# EAGLE board Armaz BBB Cape (EAGLE 7.3.0)
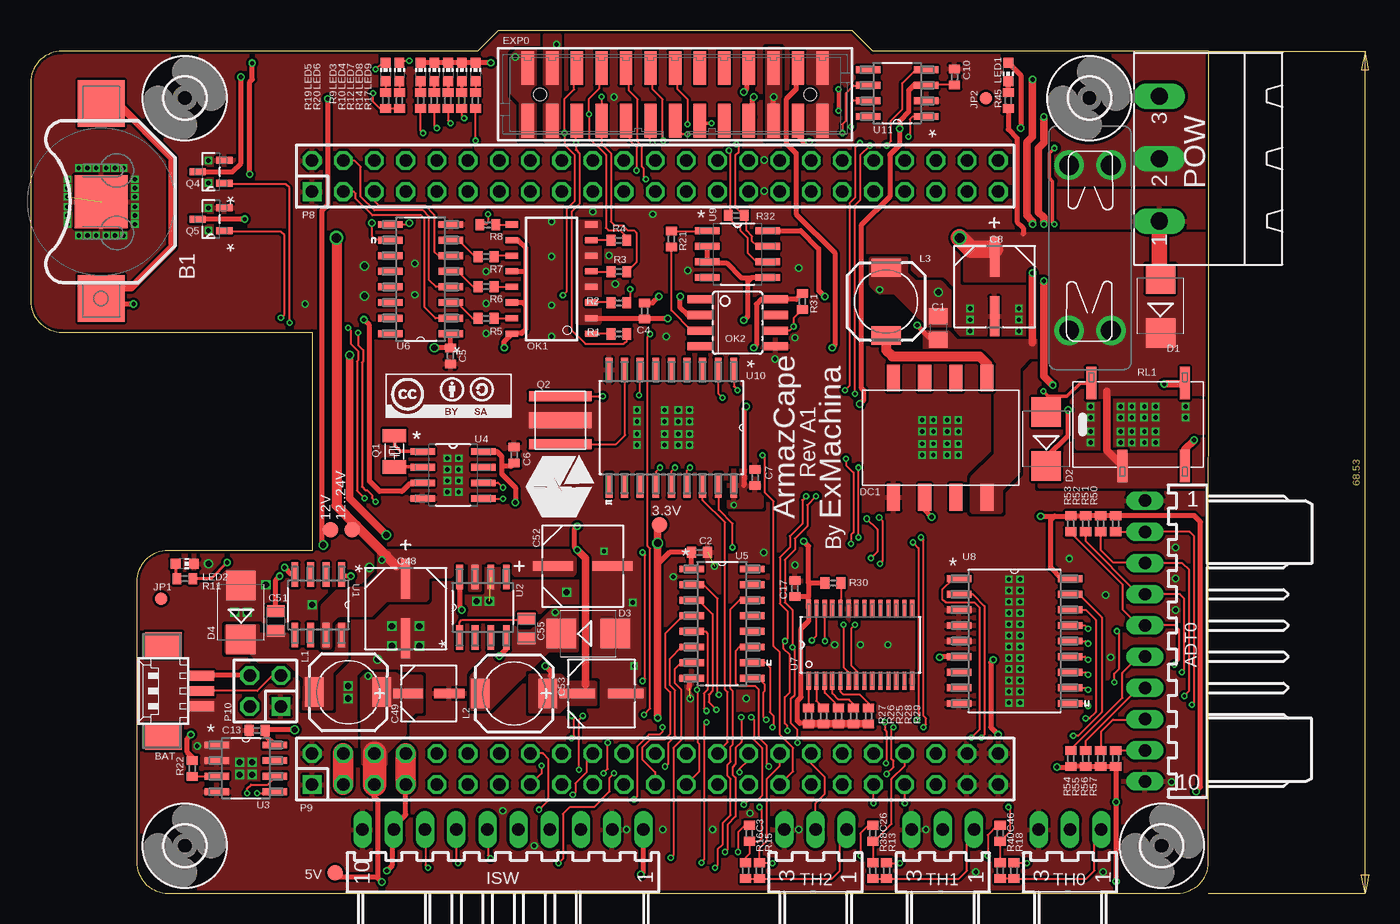
[diagram p2: board, top side]
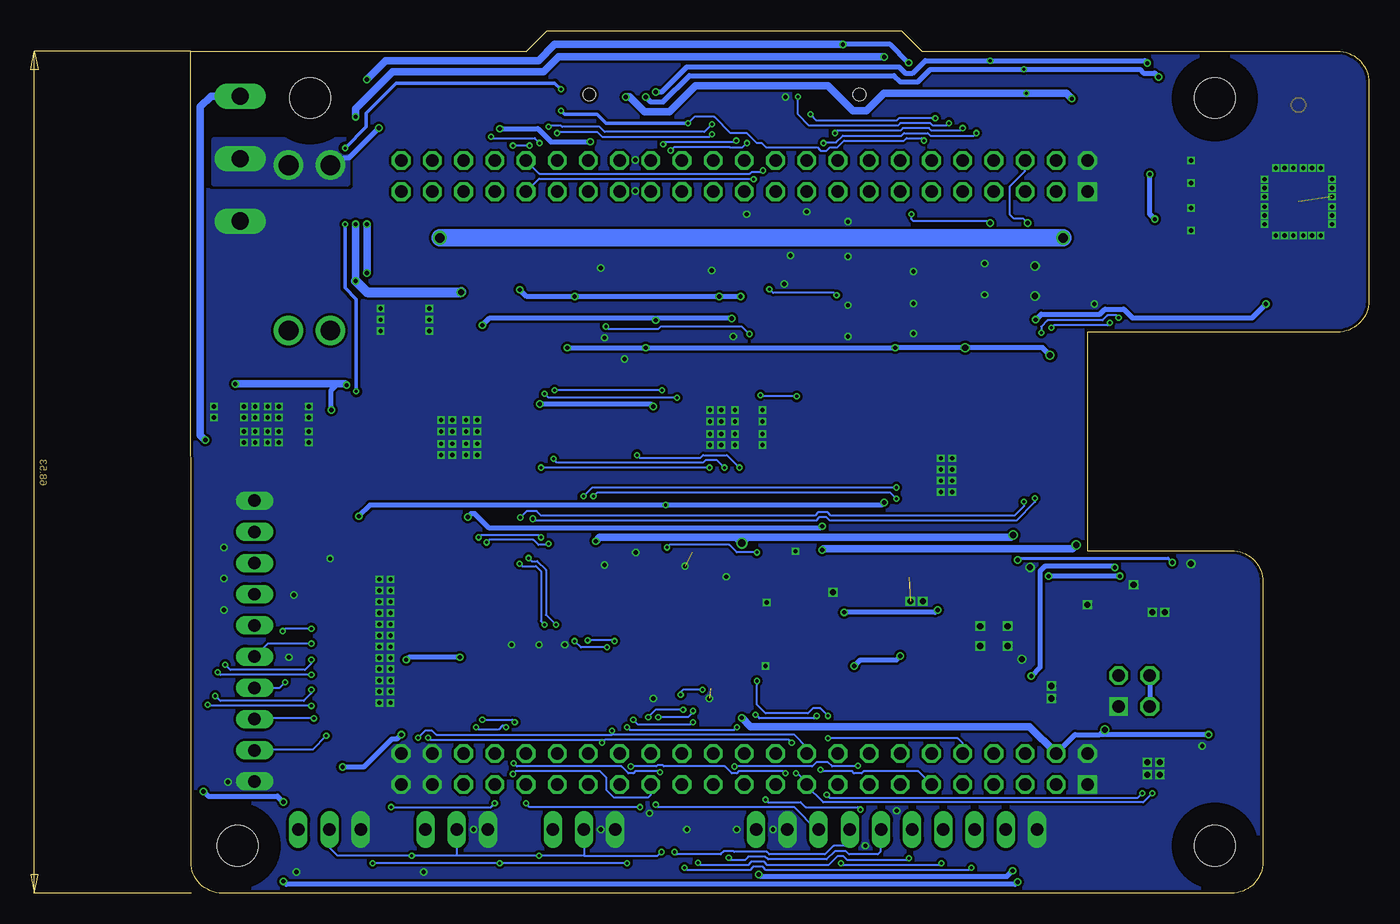
[diagram p3: board, bottom side, seen from below]

Size 95.94 x 70.2 mm. Coordinates in mm from the lower left corner, seen from the top.
Outline: 22.91,27.89 11.18,27.89 arc90 8.64,25.35 8.64,2.54 arc90 11.18,0 93.37,0 arc90 95.91,2.54 95.94,68.53 68.58,68.53 66.9,70.2 38.05,70.2 36.37,68.53 2.54,68.53 arc90 0,65.99 0,48.21 arc90 2.54,45.67 22.91,45.67 22.91,27.89
Copper layers (1*16): Top 0.018mm / dielectric 1.55mm / Bottom 0.018mm
Design rules "eC_2Layer_PClass6_BaseCopperO18_eCDefault *": minimum track width 0.15mm, minimum drill 0.25mm, track to track 0.15mm, track to pad 0.15mm, pad to pad 0.15mm, via to via 0.15mm, smd to smd 0mil, copper to edge 0.25mm, drill to drill 0.35mm, minimum pad ring 0.175mm, minimum via ring 0.125mm, stop-mask expansion 0mil, vias tented up to drill 0.45mm, thermal gap 0.2mm
Net classes: 0 default: width 0.152 mm, drill 0.2 mm, clearance 0.205 mm; 1 supply: width 0.406 mm, drill 0.35 mm, clearance 0.205 mm to class 0, clearance 0.205 mm

## Footprints (pad centres in the part's own frame; a part is rotated, then mirrored left to right if it is on the bottom)
B1,27 = smd 1.27 x 1.27: TP 0,0
7395-10 = drill 1.016 long: 1 11.43,0; 2 8.89,0; 3 6.35,0; 4 3.81,0; 5 1.27,0; 6 -1.27,0; 7 -3.81,0; 8 -6.35,0; 9 -8.89,0; 10 -11.43,0
3000 = smd 3.81 x 3.81: +1 -7.874,0; +2 8.001,0 | smd 4.318 x 4.318: - 0,0
53261-03 = smd 0.8 x 2: 1 1.25,-2.5; 2 0,-2.5; 3 -1.25,-2.5 | smd 2.1 x 3: S1 3.75,0.625; S2 -3.75,0.625
C0805 = smd 1.3 x 1.5: 1 -0.95,0; 2 0.95,0
C0402 = smd 0.7 x 0.9: 1 -0.65,0; 2 0.65,0
CAPAE660X800N = smd 3.251 x 0.762: 1 -2.413,0; 2 2.413,0
CAPAE430X610N = smd 2.464 x 0.762: 1 -1.676,0; 2 1.676,0
CAPC2013X90N = smd 0.914 x 1.448: 1 -0.813,0; 2 0.813,0
CAPAE530X610N = smd 2.87 x 0.762: 1 -1.981,0; 2 1.981,0
SMB = smd 2.4 x 2.4: A 2.2,0; C -2.2,0
NTE = smd 1.067 x 2.184: 1 -3.81,-4.85; 3 -1.27,-4.85; 5 1.27,-4.85; 7 3.81,-4.85; 8 3.81,4.85; 10 1.27,4.85; 12 -1.27,4.85; 14 -3.81,4.85
87832-26 = smd 1 x 2.75: 1 -12,-2.15; 2 -12,2.15; 3 -10,-2.15; 4 -10,2.15; 5 -8,-2.15; 6 -8,2.15; 7 -6,-2.15; 8 -6,2.15; 9 -4,-2.15; 10 -4,2.15; 11 -2,-2.15; 12 -2,2.15; 13 0,-2.15; 14 0,2.15; 15 2,-2.15; 16 2,2.15; 17 4,-2.15; 18 4,2.15; 19 6,-2.15; 20 6,2.15; 21 8,-2.15; 22 8,2.15; 23 10,-2.15; 24 10,2.15; 25 12,-2.15; 26 12,2.15 | hole 1: -11,0; 11,0
3557 = drill 1.6: 1 -6.731,-1.702; 2 -6.731,1.702; 3 6.731,-1.702; 4 6.731,1.702
3,3 = hole 3.3: 0,0
FIDUCIAL-1X2 = smd 1 x 1: 1 0,0
B82462G4 = smd 1.5 x 2.4: 1 -2.75,0; 2 2.75,0
CHIP-LED0603 = smd 0.8 x 0.8: A 0,-0.75; C 0,0.75
MINI-FLAT-16 = smd 1 x 0.5: 1 -3.24,4.445; 2 -3.24,3.175; 3 -3.24,1.905; 4 -3.24,0.635; 5 -3.24,-0.635; 6 -3.24,-1.905; 7 -3.24,-3.175; 8 -3.24,-4.445; 9 3.24,-4.445; 10 3.24,-3.175; 11 3.24,-1.905; 12 3.24,-0.635; 13 3.24,0.635; 14 3.24,1.905; 15 3.24,3.175; 16 3.24,4.445
SOIC08 = smd 0.66 x 2.032: 1 -1.905,-3.073; 2 -0.635,-3.073; 3 0.635,-3.073; 4 1.905,-3.073; 5 1.905,3.073; 6 0.635,3.073; 7 -0.635,3.073; 8 -1.905,3.073
DIL-100-2X23 = drill 1.016 square: 1 -27.94,-1.27 | drill 1.016 octagon: 2 -27.94,1.27; 3 -25.4,-1.27; 4 -25.4,1.27; 5 -22.86,-1.27; 6 -22.86,1.27; 7 -20.32,-1.27; 8 -20.32,1.27; 9 -17.78,-1.27; 10 -17.78,1.27; 11 -15.24,-1.27; 12 -15.24,1.27; 13 -12.7,-1.27; 14 -12.7,1.27; 15 -10.16,-1.27; 16 -10.16,1.27; 17 -7.62,-1.27; 18 -7.62,1.27; 19 -5.08,-1.27; 20 -5.08,1.27; 21 -2.54,-1.27; 22 -2.54,1.27; 23 0,-1.27; 24 0,1.27; 25 2.54,-1.27; 26 2.54,1.27; 27 5.08,-1.27; 28 5.08,1.27; 29 7.62,-1.27; 30 7.62,1.27; 31 10.16,-1.27; 32 10.16,1.27; 33 12.7,-1.27; 34 12.7,1.27; 35 15.24,-1.27; 36 15.24,1.27; 37 17.78,-1.27; 38 17.78,1.27; 39 20.32,-1.27; 40 20.32,1.27; 41 22.86,-1.27; 42 22.86,1.27; 43 25.4,-1.27; 44 25.4,1.27; 45 27.94,-1.27; 46 27.94,1.27
DIL-100-2X2 = drill 1.016 square: 1 -1.27,-1.27 | drill 1.016 octagon: 2 -1.27,1.27; 3 1.27,-1.27; 4 1.27,1.27
MSTBA3 = drill 1.397 long: 1 -5.08,5.08; 2 0,5.08; 3 5.08,5.08
ABS07 = smd 1.092 x 1.905: P$1 -1.27,0; P$2 1.27,0
AWSCR-MT = smd 0.8 x 5.1: 1 -1.95,0; 3 1.95,0 | smd 1.3 x 5.1: 2 0,0
SOT95P240X112-3N = smd 1.321 x 0.559: 1 -1.092,0.94; 2 -1.092,-0.94; 3 1.092,0
R0402 = smd 0.7 x 0.9: 1 -0.65,0; 2 0.65,0
G6L-1F = smd 0.8 x 2.66: 2 -1.27,-3.37; 4 3.81,-3.37; 5 3.81,3.37; 8 -3.81,3.37
7395-03 = drill 1.016 long: 1 2.54,0; 2 0,0; 3 -2.54,0
SOIC127P620X175-8N = smd 1.981 x 0.559: 1 -2.464,1.905; 2 -2.464,0.635; 3 -2.464,-0.635; 4 -2.464,-1.905; 5 2.464,-1.905; 6 2.464,-0.635; 7 2.464,0.635; 8 2.464,1.905
SOIC127P600X175-8N = smd 1.981 x 0.559: 1 -2.464,1.905; 2 -2.464,0.635; 3 -2.464,-0.635; 4 -2.464,-1.905; 5 2.464,-1.905; 6 2.464,-0.635; 7 2.464,0.635; 8 2.464,1.905
SOIC127P600X175-8N' = smd 1.981 x 0.559: 1 -2.362,1.905; 2 -2.362,0.635; 3 -2.362,-0.635; 4 -2.362,-1.905; 5 2.362,-1.905; 6 2.362,-0.635; 7 2.362,0.635; 8 2.362,1.905
SOIC127P600X175-8N'' = smd 1.981 x 0.533: 1 -2.464,1.905; 2 -2.464,0.635; 3 -2.464,-0.635; 4 -2.464,-1.905; 5 2.464,-1.905; 6 2.464,-0.635; 7 2.464,0.635; 8 2.464,1.905
SOIC127P600X175-16N = smd 1.981 x 0.559: 1 -2.464,4.445; 2 -2.464,3.175; 3 -2.464,1.905; 4 -2.464,0.635; 5 -2.464,-0.635; 6 -2.464,-1.905; 7 -2.464,-3.175; 8 -2.464,-4.445; 9 2.464,-4.445; 10 2.464,-3.175; 11 2.464,-1.905; 12 2.464,-0.635; 13 2.464,0.635; 14 2.464,1.905; 15 2.464,3.175; 16 2.464,4.445
SOP65P640X110-28N = smd 1.473 x 0.356: 1 -2.921,4.216; 2 -2.921,3.581; 3 -2.921,2.921; 4 -2.921,2.286; 5 -2.921,1.626; 6 -2.921,0.965; 7 -2.921,0.33; 8 -2.921,-0.33; 9 -2.921,-0.965; 10 -2.921,-1.626; 11 -2.921,-2.286; 12 -2.921,-2.921; 13 -2.921,-3.581; 14 -2.921,-4.216; 15 2.921,-4.216; 16 2.921,-3.581; 17 2.921,-2.921; 18 2.921,-2.286; 19 2.921,-1.626; 20 2.921,-0.965; 21 2.921,-0.33; 22 2.921,0.33; 23 2.921,0.965; 24 2.921,1.626; 25 2.921,2.286; 26 2.921,2.921; 27 2.921,3.581; 28 2.921,4.216
SOIC127P1030X265-18N = smd 1.981 x 0.559: 1 -4.521,5.08; 2 -4.521,3.81; 3 -4.521,2.54; 4 -4.521,1.27; 5 -4.521,0; 6 -4.521,-1.27; 7 -4.521,-2.54; 8 -4.521,-3.81; 9 -4.521,-5.08; 10 4.521,-5.08; 11 4.521,-3.81; 12 4.521,-2.54; 13 4.521,-1.27; 14 4.521,0; 15 4.521,1.27; 16 4.521,2.54; 17 4.521,3.81; 18 4.521,5.08
SOIC127P1034X264-18N = smd 1.981 x 0.559: 1 -4.699,5.08; 2 -4.699,3.81; 3 -4.699,2.54; 4 -4.699,1.27; 5 -4.699,0; 6 -4.699,-1.27; 7 -4.699,-2.54; 8 -4.699,-3.81; 9 -4.699,-5.08; 10 4.699,-5.08; 11 4.699,-3.81; 12 4.699,-2.54; 13 4.699,-1.27; 14 4.699,0; 15 4.699,1.27; 16 4.699,2.54; 17 4.699,3.81; 18 4.699,5.08

## Placement (x,y rotation side)
3.3V  TPB1,27  [B1,27]  51.21,29.97 0 top
5V  TPB1,27  [B1,27]  24.79,1.68 0 top
12..24V  TPB1,27  [B1,27]  26.16,29.57 90 top
12V  TPB1,27  [B1,27]  24.43,29.57 0 top
ADT0  22-05-7108-10  [7395-10]  90.73,20.52 90 top
B1  3000  [3000]  5.74,56.29 90 top
BAT  53261-03  [53261-03]  11.43,16.46 90 top
C1  4.7uF  [C0805]  73.9,46 270 top
C2  0.1uF  [C0402]  54.46,27.74 0 top
C3  4.7uF  [C0402]  58.52,4.88 90 top
C4  0.1uF  [C0402]  49.99,47.4 270 top
C5  0.1uF  [C0402]  34.19,43.74 270 top
C6  0.1uF  [C0402]  39.37,35.66 90 top
C7  0.1uF  [C0402]  58.98,33.83 90 top
C8  100UF  [CAPAE660X800N]  78.49,49.38 270 top
C10  0.1uF  [C0402]  75.23,66.45 90 top
C13  0.1uF  [C0402]  18.44,13.26 180 top
C17  0.1uF  [C0402]  62.23,24.79 90 top
C26  4.7uF  [C0402]  68.58,4.88 90 top
C46  4.7uF  [C0402]  78.94,4.88 90 top
C48  150UF  [CAPAE660X800N]  30.53,23.16 270 top
C49  68UF  [CAPAE430X610N]  32.41,16.26 0 top
C51  10nF  [CAPC2013X90N]  19.96,22.15 270 top
C52  150UF  [CAPAE660X800N]  44.96,26.62 0 top
C53  47UF  [CAPAE530X610N]  46.48,16.26 0 top
C55  10nF  [CAPC2013X90N]  40.39,21.54 270 top
D1  3A, 60V  [SMB]  92,47.8 90 top
D2  3A, 60V  [SMB]  82.7,36.98 90 top
D3  3A, 60V  [SMB]  45.42,21.13 0 top
D4  3A, 60V  [SMB]  17.12,22.86 90 top
DC1  NTE1205MC  [NTE]  74.07,37.08 0 top
EXP0  87832-26  [87832-26]  52.48,65.02 0 top
FU0  FUSE3557  [3557]  86.26,52.53 270 top
H1  MOUNT-HOLE3.3  [3,3]  12.55,64.72 0 top
H2  MOUNT-HOLE3.3  [3,3]  86.21,64.72 0 top
H3  MOUNT-HOLE3.3  [3,3]  92.1,3.86 0 top
H4  MOUNT-HOLE3.3  [3,3]  12.55,3.86 0 top
ISW  22-05-7108-10  [7395-10]  38.46,5.18 0 top
JP1  FIDUCIAL1X2  [FIDUCIAL-1X2]  10.62,23.98 0 top
JP2  FIDUCIAL1X2  [FIDUCIAL-1X2]  77.78,64.72 0 top
L1  47uH  [B82462G4]  25.86,16.36 0 top
L2  68uH  [B82462G4]  39.37,16.26 0 top
L3  1uH  [B82462G4]  69.65,48.16 90 top
LED1  red  [CHIP-LED0603]  79.6,66.85 180 top
LED2  blue  [CHIP-LED0603]  12.55,26.82 270 top
LED3  blue  [CHIP-LED0603]  31.75,66.85 0 top
LED4  blue  [CHIP-LED0603]  32.87,66.85 0 top
LED5  blue  [CHIP-LED0603]  28.91,66.85 0 top
LED6  blue  [CHIP-LED0603]  30.02,66.85 0 top
LED7  blue  [CHIP-LED0603]  33.99,66.85 0 top
LED8  blue  [CHIP-LED0603]  35.1,66.85 0 top
LED9  blue  [CHIP-LED0603]  36.22,66.85 0 top
OK1  TLP283-4  [MINI-FLAT-16]  42.42,49.99 180 top
OK2  HCPL0601  [SOIC08]  57.56,46.43 270 top
P8  F-2X23-  [DIL-100-2X23]  50.85,58.37 0 top
P9  F-2X23-  [DIL-100-2X23]  50.85,10.11 0 top
P10  F-2X2-  [DIL-100-2X2]  19.1,16.46 90 top
POW  MSTBA3  [MSTBA3]  96.98,59.79 90 top
Q1  32.768kHz, 12.5pF  [ABS07]  29.62,35.97 270 top
Q2  16MHz, 22pF  [AWSCR-MT]  43.13,38.51 90 top
Q4  [SOT95P240X112-3N]  14.68,58.72 180 top
Q5  [SOT95P240X112-3N]  14.68,54.86 180 top
R1  R100  [R0402]  47.9,45.52 0 top
R2  R100  [R0402]  47.9,48.06 0 top
R3  R100  [R0402]  47.9,50.6 0 top
R4  R100  [R0402]  47.9,53.14 0 top
R5  1k  [R0402]  37.08,46.79 180 top
R6  1k  [R0402]  37.08,49.38 0 top
R7  1k  [R0402]  37.08,51.82 0 top
R8  1k  [R0402]  37.24,54.41 0 top
R9  1.5K  [R0402]  31.75,64.52 270 top
R10  1.5K  [R0402]  32.87,64.52 270 top
R11  4.7K  [R0402]  12.55,25.6 0 top
R12  1.5K  [R0402]  33.99,64.52 270 top
R13  4K7, 1%  [R0402]  69.7,1.83 90 top
R14  1.5K  [R0402]  35.1,64.52 270 top
R15  4K7, 1%  [R0402]  59.33,1.83 90 top
R16  10K  [R0402]  58.22,1.83 90 top
R17  1.5K  [R0402]  36.22,64.52 270 top
R18  4K7, 1%  [R0402]  80.06,1.83 90 top
R19  4.7K  [R0402]  28.91,64.52 270 top
R20  4.7K  [R0402]  30.02,64.52 270 top
R21  470  [R0402]  52.17,53.24 270 top
R22  4.7K  [R0402]  13.16,10.16 90 top
R25  4.7K  [R0402]  65.79,14.43 270 top
R26  4.7K  [R0402]  64.57,14.43 270 top
R27  4.7K  [R0402]  63.35,14.43 270 top
R28  4.7K  [R0402]  67.01,14.43 270 top
R29  4.7K  [R0402]  68.22,14.43 270 top
R30  4.7K  [R0402]  65.33,25.25 180 top
R31  3K3  [R0402]  62.84,48.16 270 top
R32  120, DNI  [R0402]  57.46,55.17 0 top
R38  10K  [R0402]  68.58,1.83 90 top
R40  10K  [R0402]  78.94,1.83 90 top
R45  4.7K  [R0402]  79.6,64.52 90 top
R50  10K  [R0402]  88.34,30.07 270 top
R51  10K  [R0402]  87.12,30.07 270 top
R52  10K  [R0402]  85.9,30.07 270 top
R53  10K  [R0402]  84.68,30.07 270 top
R54  10K  [R0402]  84.68,10.97 90 top
R55  10K  [R0402]  85.9,10.97 90 top
R56  10K  [R0402]  87.12,10.97 90 top
R57  10K  [R0402]  88.34,10.97 90 top
RL1  G6L5VDC  [G6L-1F]  90.17,38.15 0 top
TH0  22-05-7038-03  [7395-03]  84.63,5.18 0 top
TH1  22-05-7038-03  [7395-03]  74.27,5.18 0 top
TH2  22-05-7038-03  [7395-03]  63.91,5.18 0 top
U1  LM2675M-5.0  [SOIC127P620X175-8N]  23.42,23.47 270 top
U2  LM2675M-12  [SOIC127P600X175-8N]  36.83,23.27 90 top
U3  24AA256-I/SN  [SOIC127P600X175-8N']  17.53,10.16 0 top
U4  DS1307ZN+  [SOIC127P600X175-8N'']  34.39,34.04 0 top
U5  CD4050BD  [SOIC127P600X175-16N]  56.29,21.95 0 top
U6  CD4050BD  [SOIC127P600X175-16N]  31.75,49.99 180 top
U7  PCA9685PW  [SOP65P640X110-28N]  67.56,20.22 90 top
U8  MCP23008-E/SO  [SOIC127P1030X265-18N]  80.11,20.52 0 top
U9  SN65HVD08D  [SOIC127P600X175-8N]  57.56,52.02 0 top
U10  MCP2515-I/SO  [SOIC127P1034X264-18N]  52.17,37.9 270 top
U11  MCP2551-I/SN  [SOIC127P600X175-8N']  70.56,65.13 180 top
U$1  EXMACHINA-LOGO  [EXM-LOGO]  43.03,33.07 0 top
U$2  CC-BY-SA  [CC-BY-SA]  34.19,40.94 0 top

## Tracks (layer width: path | path; a pad name or v marks a point on that pad's centre or on a via)
$1  (via drill 0.35)
  Top 0.406: C51.1 19.96,25.5 v20.27,25.81 | v26.06,25.81 25.45,25.81 U1.1
  Bottom 0.406: v20.27,25.81 v26.06,25.81
+3V3  (via drill 0.35, 0.5, 0.5 pad 0.25, 0.6)
  Top 0.406: v21.49,13.31 19.14,13.31 C13.1 19.09,12.86 U3.8 | v62.94,28.65 63.34,28.25 63.34,25.25 63.35,25.25 | R30.2 63.35,25.25 | 63.35,25.25 63.35,24.13 | 63.34,24.14 C17.1 | 63.35,24.13 U7.28 63.35,22.15 62.74,21.54 62.74,15.95 62.43,15.65 62.43,14.02 62.64,13.82 63.31,13.82 R27.2 | 63.35,24.13 63.34,24.14 | 63.34,24.14 63.3,24.18 | U5.1 53.82,27.72 C2.1 52.02,27.74 51.05,26.77 | OK1.10 39.7,53.16 40.29,52.58 40.29,50.6 | 40.29,50.6 40.29,47.85 | 40.29,47.85 40.29,45.87 39.98,45.57 39.2,45.57 OK1.16 38.56,44.92 v38.56,44.4 | OK1.14 40.06,48.08 40.29,47.85 | OK1.12 40.26,50.62 40.29,50.6 | U6.1 34.19,45.52 C5.1 34.15,44.35 34.1,44.4 v32.87,44.4 | v58.88,44.4 59.08,44.6 59.08,47.95 59.46,48.34 OK2.8 62.37,48.34 R31.1 | R22.2 13.16,11.07 12.75,11.48 12.75,12.6 v13.06,12.9 | EXP0.24 62.33,67.03 62.33,65.43 61.52,64.62 61.52,61.06 62.33,60.25 62.33,55.27 65.48,52.12 65.48,44.6 v65.28,44.4
  Top 0.61: 3.3V.TP 51.05,29.82 v51.05,28.5 51.05,26.77 v51.05,14.27 | R29.2 R28.2 R25.2 R26.2 R27.2 | v28.96,29.16 25.96,32.16 v25.96,43.79
  Top 1.676: P9.4 P9.3
  Bottom 0.406: P9.4 23.93,12.9 21.89,12.9 | v25.96,43.79 26.57,44.4 v32.87,44.4 v38.56,44.4 v58.88,44.4 v65.28,44.4 | 21.89,12.9 v21.49,13.31 | v13.06,12.9 21.89,12.9
  Bottom 0.61: P9.4 27.63,13.56 50.34,13.56 v51.05,14.27 | 51.51,28.96 v51.05,28.5 50.6,28.96 | 51.51,28.96 62.64,28.96 v62.94,28.65 | v28.96,29.16 29.16,28.96 50.6,28.96 | 50.6,28.96 51.51,28.96
+5V  (via drill 0.25, 0.35)
  Top 0.152: U11.3 72.96,65.8 C10.1 72.84,65.8 72.8,65.84 71.98,65.84 | 58.96,33.2 C7.1
  Top 0.406: v88.39,0.96 v88.39,7.42 88.39,10.27 R57.1 R56.1 R55.1 R54.1 84.68,10.26 v83.57,10.26 | 28.24,1.27 28.24,7.57 27.94,7.87 27.94,8.79 P9.5 | 28.24,1.27 v28.6,0.91 | U8.6 74.07,19.25 v74.02,19.2 | v78.39,19 78.18,18.8 78.18,13.51 v78.79,12.9 | U8.18 83.97,25.6 83.06,26.52 83.06,30.38 83.36,30.68 | 83.36,30.68 84.64,30.68 R53.1 R52.1 R51.1 R50.1 88.4,30.79 88.4,30.77 88.44,30.73 94.74,30.73 95.25,30.23 95.25,8.64 v94.89,8.28 | 36.88,35.97 36.93,35.97 | 36.93,35.97 37.95,35.97 38.35,35.56 38.35,34.75 | 38.35,34.75 38.35,34.14 39.47,33.02 v39.47,31.8 | v82.25,30.68 83.36,30.68 | 38.35,34.75 39.11,34.75 C6.1 | 71.98,65.84 71.48,65.33 71.48,63.6 70.77,62.89 v70.77,62.23 70.77,60.91 69.95,60.1 69.95,56.69 67.61,54.36 67.61,41.15 67.82,40.94 67.82,40.13 v67.51,39.83 | v58.27,39.62 58.07,39.42 58.07,33.2 | 5V.TP 25.15,1.32 28.19,1.32 28.24,1.27 | U4.8 36.91,35.94 36.93,35.97 | EXP0.23 62.66,62.69 62.64,62.66 62.64,61.47 62.94,61.16 v63.4,61.16 | U1.4 21.26,25.93 v20.68,26.52
  Top 1.93: P9.5 P9.6
  Bottom 0.406: v88.39,0.96 88.14,0.71 28.8,0.71 v28.6,0.91 | v74.02,19.2 78.18,19.2 v78.39,19 | v78.79,12.9 79.15,12.55 79.55,12.55 81.84,10.26 v83.57,10.26 | v39.47,31.8 39.68,31.6 v57.25,31.6 81.33,31.6 v82.25,30.68 | v94.89,8.28 94.51,7.9 88.88,7.9 v88.39,7.42 | v67.51,39.83 58.47,39.83 v58.27,39.62 | v70.77,62.23 67.67,62.23 66.6,61.16 v63.4,61.16 | v20.68,26.52 20.78,26.62 26.36,26.62 26.77,26.21 26.77,18.39 v27.48,17.68
  pour Top (no thermals): 26.97,17.37 26.97,15.54 27.08,10.57 28.91,10.57 28.91,11.48 30.43,13 30.43,14.02 31.24,14.83 31.8,14.83 31.8,17.58 29.92,17.58 29.72,17.78 27.38,17.78
  pour Top: 56.85,34.34 56.85,31.5 59.49,31.5 59.49,33.93 58.37,33.93 58.37,34.34
+5V/1  (via drill 0.35, 0.5)
  Top 0.406: C4.1 50.64,48.05 v51.16,48.56 | D2.C 82.7,35.51 84.48,37.29 v84.48,39.32 | U9.8 62.71,53.92 64.16,52.48 64.16,49.07 v64.67,48.56 | OK2.2 53.47,47.07 52.88,47.65 v52.88,48.56
  Top 0.61: v82.5,63.2 82.5,61.09 82.07,60.66 82.07,55.45 82.5,55.02 v82.5,54.46 | v82.5,49.83 82.5,42.09 v83.24,41.35 | v92.3,41.45 93.91,41.45 RL1.5
  Bottom 0.406: v51.16,48.56 v52.88,48.56 v64.67,48.56 68.58,48.56 v69.14,49.12 | v84.48,39.32 84.48,40.94 83.97,41.45
  Bottom 0.609: 39.88,68.07 65.99,68.07 67.21,66.85 79.5,66.85
  Bottom 0.61: 79.5,66.85 82.5,63.86 v82.5,63.2 | v82.5,54.46 v82.5,49.83 | v83.24,41.35 83.34,41.45 83.97,41.45 v92.3,41.45 | 39.88,68.07 v39.47,68.07
  Bottom 0.813: v82.5,49.83 81.59,48.92 v73.91,48.92
  pour Top (rank 2, no thermals): 74.83,46.13 74.83,48.97 74.12,49.68 71.98,49.68 71.27,50.39 71.27,51.61 68.43,51.61 68.43,49.58 69.04,48.97 70.36,48.97 73.2,46.13
  pour Top (no thermals): 41,68.58 41,61.37 39.98,61.37 39.98,64.41 39.27,65.13 39.27,68.17 39.68,68.58
ADT0  (via drill 0.25)
  Top 0.152: R50.2 90.72,29.42 ADT0.2 94.39,29.41 94.74,29.06 94.74,15.55 v94.54,15.34 | U8.10 85.9,15.44 v86.11,15.24
  Bottom 0.152: v86.11,15.24 94.44,15.24 v94.54,15.34
ADT1  (via drill 0.25)
  Top 0.152: R51.2 87.16,29.38 87.16,27.9 88.14,26.92 90.68,26.92 ADT0.3 93.78,26.87 94.34,26.31 94.34,16.46 v93.93,16.05 | U8.11 85.95,16.71 v86.11,16.56
  Bottom 0.152: v86.11,16.56 86.11,16.26 86.72,15.65 93.52,15.65 v93.93,16.05
ADT2  (via drill 0.25)
  Top 0.152: 85.84,29.42 R52.2 85.9,28.65 90.17,24.38 90.68,24.38 ADT0.4 93.57,24.33 93.93,23.98 93.93,18.19 v93.73,17.98 | U8.12 85.9,17.98 v86.11,17.78
  Bottom 0.152: v86.11,17.78 93.52,17.78 v93.73,17.98
ADT3  (via drill 0.25)
  Top 0.152: R53.2 84.62,29.42 88.9,25.15 88.9,23.11 90.17,21.84 90.68,21.84 ADT0.5 93.17,21.79 93.52,21.44 93.52,19 v93.12,18.59 | U8.13 85.85,19.25 v86.11,19
  Bottom 0.152: v86.11,19 86.11,18.69 86.61,18.19 92.71,18.19 v93.12,18.59
ADT4  (via drill 0.25)
  Top 0.152: ADT0.6 90.68,19.2 90.17,19.2 88.9,17.93 88.9,15.9 84.62,11.62 R54.2 | U8.14 85.9,20.52 v86.11,20.32
  Bottom 0.152: v86.11,20.32 89.66,20.32 ADT0.6
ADT5  (via drill 0.25)
  Top 0.152: R55.2 85.9,12.39 90.22,16.71 ADT0.7 | v88.24,17.17 88.24,17.88 88.65,18.29 88.65,21.13 v88.44,21.34 | U8.15 85.85,21.79 v86.11,21.54
  Bottom 0.152: ADT0.7 88.7,16.71 v88.24,17.17 | v88.44,21.34 88.24,21.54 v86.11,21.54
ADT6  (via drill 0.25)
  Top 0.152: R56.2 87.16,11.66 87.16,13.15 88.14,14.12 90.68,14.12 ADT0.8 | U8.16 85.9,23.06 86.72,22.25 86.72,14.73 86.21,14.22 v85.9,14.22
  Bottom 0.152: v85.9,14.22 90.68,14.22 ADT0.8
ADT7  (via drill 0.25)
  Top 0.152: R57.2 90.72,11.62 ADT0.9 | U8.17 85.34,24.33 87.22,22.45 87.22,14.73 85.29,12.8 v84.89,12.8
  Bottom 0.152: v84.89,12.8 86,11.68 90.68,11.68 ADT0.9
AGND  (via drill 0.25)
  Top 0.152: C26.2 68.21,5.53 67.56,4.88 v67.56,3.05 | C46.2 78.73,5.53 77.93,4.72 v77.93,3.05 | C3.2 58.16,5.53 57.61,4.98 v57.61,3.35 | TH2.2 63.91,7.31 64.67,8.08 64.67,9.45 63.55,10.57 P9.34
  Bottom 0.152: 63.91,3.81 TH2.2 63.91,3.05 | 63.91,3.05 v67.56,3.05 74.27,3.05 | 74.27,3.05 v77.93,3.05 83.97,3.05 84.58,3.66 84.58,5.13 TH0.2 | TH1.2 74.27,3.05 | 63.91,3.05 57.91,3.05 v57.61,3.35
BAT
  Top 0.406: P10.4 13.95,17.73 BAT.1
  Bottom 0.406: P10.4 P10.2
BAT_TEMP
  Top 0.152: P10.3 19.71,17.73 18.44,16.46 BAT.2
CAN0-H  (via drill 0.25)
  Top 0.152: v53.49,62.59 53.49,64.62 52.68,65.43 52.68,66.97 EXP0.14 | U11.7 66.98,64.49 66.8,64.31 v66.8,62.38
  Bottom 0.152: v53.49,62.59 54.1,61.98 62.23,61.98 62.64,62.38 65.69,62.38 65.79,62.48 66.7,62.48 v66.8,62.38
CAN0-L  (via drill 0.25)
  Top 0.152: v66.09,61.87 66.09,62.59 66.4,62.89 66.4,65.12 67,65.73 68.17,65.73 U11.6 | v53.49,61.77 53.09,61.77 52.48,62.38 EXP0.13
  Bottom 0.152: v53.49,61.77 53.7,61.57 62.43,61.57 62.84,61.98 65.99,61.98 v66.09,61.87
CAN0_RX  (via drill 0.25)
  Top 0.152: U10.2 55.98,40.69 v56.34,40.33 | v67.11,40.64 67.11,55.98 67.56,56.44 67.56,60.1 v68.33,60.86 | v69.7,60.86 70.05,61.21 70.05,62.89 70.97,63.81 70.97,65.94 71.98,66.95 72.85,66.95 U11.4
  Bottom 0.152: v56.34,40.33 66.8,40.33 v67.11,40.64 | v68.33,60.86 v69.7,60.86
CAN0_TX  (via drill 0.25)
  Top 0.152: U10.1 57.25,41.25 v57.56,40.94 | v66.29,40.94 66.7,41.35 66.7,56.19 67.16,56.64 67.16,60.71 v67.51,61.06 | U11.1 71.81,63.22 71.58,62.99 71.58,61.67 v71.48,61.57
  Bottom 0.152: v57.56,40.94 v66.29,40.94 | v71.48,61.57 71.37,61.47 67.92,61.47 v67.51,61.06
DMX0-A  (via drill 0.25)
  Top 0.152: 57,54.81 57,60.3 v56.84,60.45 | v50.65,61.06 50.45,61.27 50.45,62.84 EXP0.11 | 57,54.81 56.8,55.01 R32.1 | 57,54.81 57.35,54.46 57.56,54.46 57.76,54.25 57.76,53.95 58.37,53.34 58.37,52.12 59.11,51.38 U9.6
  Bottom 0.152: v56.84,60.45 56.54,60.76 52.07,60.76 52.02,60.71 51,60.71 v50.65,61.06
DMX0-B  (via drill 0.25)
  Top 0.152: v57.46,60.96 57.66,60.76 57.66,60.35 57.4,60.1 57.4,55.83 58.07,55.17 R32.2 58.27,55.01 58.27,53.95 58.75,53.47 58.75,53.06 59.08,52.73 59.94,52.73 U9.7 | v51.51,61.27 51.46,61.31 51.46,64.62 50.65,65.43 50.65,67 EXP0.12
  Bottom 0.152: v57.46,60.96 57.25,61.16 51.61,61.16 v51.51,61.27
DRVEN_OUT  (via drill 0.35)
  Top 0.61: v94.74,36.88 93.98,36.12 RL1.4
  Bottom 0.61: POW.3 94.28,64.87 95.15,64.01 95.15,37.29 v94.74,36.88
DV0  (via drill 0.25)
  Top 0.152: v36.22,61.27 R17.2
  Top 0.305: v83.36,54.46 83.21,54.61 83.21,57.96 82.96,58.22 82.96,60.25 v83.36,60.66 | v65.79,65.43 v65.79,63.7 | v82.45,40.84 82.86,40.44 | 82.86,40.44 84.38,40.44 85.46,41.52 RL1.8 | 82.86,40.44 82.7,40.28 D2.A | v55.42,62.69 54.66,62.69 EXP0.15
  Bottom 0.152: v36.22,61.27 36.42,61.47 37.64,61.47 37.85,61.27 42.72,61.27 43.28,60.71 43.89,60.71 44.15,60.45 44.65,60.45 44.91,60.71 49.07,60.71 49.43,61.06 49.84,61.06 50.65,61.87 51.97,61.87 53.29,63.2 54.91,63.2 v55.42,62.69
  Bottom 0.305: v82.45,40.84 82.45,48.36 83.36,49.28 v83.36,54.46 | v83.36,60.66 81.64,62.38 81.64,63.5 79.2,65.94 66.29,65.94 v65.79,65.43 | v65.79,63.7 65.48,63.4 62.84,63.4 62.13,62.69 v55.42,62.69
ESW0  (via drill 0.25)
  Top 0.152: v31.95,61.87 31.75,62.08 R9.2 | R1.2 48.55,44.95 48.31,44.7 45.16,44.7 44.04,45.82 44.04,55.47 44.7,56.13 44.7,60.2 44.4,60.5 v44.4,61.06 44.4,62.8 EXP0.5
  Bottom 0.152: v44.4,61.06 44.35,61.11 43.38,61.11 42.83,61.67 38.05,61.67 37.85,61.87 35.92,61.87 35.71,61.67 32.16,61.67 v31.95,61.87
ESW1  (via drill 0.25)
  Top 0.152: v43.33,48.67 43.64,48.97 43.64,55.68 44.3,56.34 44.3,60.1 43.48,60.91 v43.48,61.87 43.48,64.67 44.25,65.43 44.25,66.94 EXP0.6 | v48.82,49.17 48.82,48.32 R2.2 | R10.2 32.87,62.48 v33.07,62.28
  Bottom 0.152: v33.07,62.28 33.27,62.08 35.61,62.08 35.81,62.28 37.95,62.28 38.15,62.08 43.28,62.08 v43.48,61.87 | v43.33,48.67 43.54,48.87 48.51,48.87 v48.82,49.17
ESW2  (via drill 0.25)
  Top 0.152: R12.2 33.98,62.89 v34.19,62.69 | R3.2 49.33,51.37 49.33,53.75 49.12,53.95 48.62,53.95 48.21,54.36 47.55,54.36 47.24,54.66 47.24,60.25 46.48,61.01 EXP0.7 v46.48,64.82
  Bottom 0.152: v34.19,62.69 34.39,62.48 35.51,62.48 35.71,62.69 38.15,62.69 38.35,62.48 45.57,62.48 46.48,63.4 v46.48,64.82
ESW3  (via drill 0.25)
  Top 0.152: R4.2 48.55,53.4 48.01,53.95 47.04,53.95 46.84,54.15 46.84,60.1 45.47,61.47 v45.47,63.4 45.47,64.67 46.28,65.48 46.28,66.98 EXP0.8 | R14.2 35.1,63.3 v35.31,63.09
  Bottom 0.152: v35.31,63.09 38.25,63.09 38.46,62.89 44.96,62.89 v45.47,63.4
FAN0  (via drill 0.25, 0.3)
  Top 0.152: v25.86,46.03 26.06,45.82 26.06,44.7 26.67,44.09 26.67,43.38 26.57,43.28 26.57,32.77 v27.18,32.16 | v68.07,30.48 68.94,29.62 68.94,27.79 v68.43,27.28 | v66.19,21.84 66.19,18.39 66.6,17.98 U7.6 | v21.08,46.43 21.08,57.4 20.78,57.71 15.85,57.71 Q4.1
  Bottom 0.152: v25.86,46.03 25.65,46.23 21.29,46.23 v21.08,46.43 | v27.18,32.16 27.18,31.85 28.7,30.33 43.89,30.33 44.15,30.58 44.76,30.58 45.01,30.33 67.92,30.33 v68.07,30.48 | v68.43,27.28 68.17,27.03 67.72,27.03 67,26.31 67,22.66 v66.19,21.84
FAN0_GND  (via drill 0.25, 0.35)
  Top 0.152: LED5.C 28.64,67.6 v28.09,67.06
  Top 0.406: Q4.3 16.41,58.73 17.12,59.44 v17.12,66.45 | EXP0.19 58.78,63.17 58.78,64.72 v58.88,64.82
  Bottom 0.406: v58.88,64.82 58.47,64.41 57.46,64.41 55.32,66.55 38.66,66.55 38.15,66.04 36.73,66.04 35.71,67.06 v28.09,67.06 18.64,67.06 18.34,66.75 17.42,66.75 v17.12,66.45
FAN1  (via drill 0.25, 0.3)
  Top 0.152: v26.67,45.62 26.67,44.6 27.08,44.2 27.08,43.28 26.97,43.18 26.97,33.07 27.23,32.82 27.38,32.82 27.79,32.41 27.79,32.16 v28.09,31.85 | v69.09,30.58 69.34,30.33 69.34,27.03 v69.14,26.82 | v67.11,21.84 66.8,21.54 66.8,18.54 67.23,18.11 U7.7 | v20.37,46.84 20.68,47.14 20.68,53.54 20.37,53.85 15.85,53.85 Q5.1
  Bottom 0.152: v26.67,45.62 26.67,46.13 26.16,46.63 21.69,46.63 21.29,47.04 20.57,47.04 v20.37,46.84 | v28.09,31.85 28.09,31.5 28.85,30.73 43.79,30.73 44.04,30.99 44.86,30.99 45.11,30.73 67.41,30.73 67.77,31.09 68.58,31.09 v69.09,30.58 | v69.14,26.82 68.94,26.62 67.82,26.62 67.41,26.21 67.41,22.15 v67.11,21.84
FAN1_GND  (via drill 0.25, 0.35)
  Top 0.152: LED6.C 30.19,67.77 v30.84,67.77
  Top 0.406: v17.42,54.86 Q5.3 | EXP0.20 58.27,66.97 58.27,65.43 v58.07,65.23 | v17.83,58.52 17.83,66.04 18.03,66.24 v18.03,67.56
  Bottom 0.406: v17.83,58.52 17.83,55.27 v17.42,54.86 | v58.07,65.23 57.56,65.23 55.52,67.26 38.25,67.26 37.75,66.75 37.14,66.75 36.12,67.77 v30.84,67.77 18.24,67.77 v18.03,67.56
GND  (via drill 0.35, 0.5)  (4 unrouted)
  Top 0.406: U5.8 53.59,17.27 53.59,16.66 | 91.9,50.9 91.9,50.05 arc45 D1.A
  Top 1.27: POW.1 91.9,50.9
  other vias: 28.24,19.05 14.48,26.82 31.65,20.12 29.41,21.74 29.41,20.12 31.65,21.74 25.86,16.87 25.86,15.85 17.02,10.67 76.96,1.73 87.33,1.73 62.54,5.18 72.9,5.18 53.7,15.85 27.18,48.62 27.18,51.05 31.29,51.26 31.29,48.72 52.32,25.76 59.69,27.74 55.68,26.62 37.08,50.6 37.08,48.01 42.42,54.66 42.42,45.31 42.42,47.85 42.42,51.82 37.08,45.57 45.77,55.47 22.35,47.95 84.58,27.23 87.53,24.28 93.22,28.14 93.22,25.6 93.22,23.06 33.93,34.49 34.85,34.49 34.85,33.58 33.93,33.58 47.09,51.92 62.23,26.72 92.91,9.04 8.48,58.12 8.48,54.46 8.48,55.17 8.48,55.88 8.48,56.69 8.48,57.4 7.57,53.54 6.86,53.54 6.15,53.54 3.91,53.54 4.62,53.54 5.33,53.54 3,54.46 3,55.17 3,55.88 3,58.12 3,57.4 3,56.69 3.91,59.03 4.62,59.03 5.33,59.03 7.57,59.03 6.86,59.03 6.15,59.03 74.63,36.58 74.63,37.59 73.51,37.59 73.51,36.58 72.59,37.59 72.59,36.58 75.54,36.58 75.54,37.59 74.63,38.51 75.54,38.51 75.54,35.66 74.63,35.66 73.51,35.66 72.59,35.66 72.59,38.51 73.51,38.51 90.68,38.71 89.66,38.71 89.66,37.59 90.68,37.59 91.59,37.59 91.59,38.71 88.75,38.71 88.75,37.59 88.75,36.68 89.66,36.68 90.68,36.68 91.59,36.68 91.59,39.62 90.68,39.62 89.66,39.62 88.75,39.62 94.03,38.71 94.03,39.62 86.31,38.71 86.31,37.59 86.31,36.68 86.31,39.62 47.6,49.58 53.49,50.7 60.6,43.48 55.52,5.18 58.57,6.5 58.27,15.85 48.51,5.18 51.46,5.18 38.46,6.71 41,3.86 65.48,20.22 67.56,20.22 69.8,20.22 80.57,20.07 79.65,20.07 79.65,20.98 80.57,20.98 33.93,32.66 34.85,32.66 34.85,35.41 33.93,35.41 80.57,21.89 79.65,21.89 79.65,19.15 80.57,19.15 87.94,19.2 79.65,15.49 80.57,15.49 80.57,16.41 79.65,16.41 79.65,17.32 80.57,17.32 80.57,18.24 79.65,18.24 79.65,22.81 80.57,22.81 80.57,23.72 79.65,23.72 79.65,24.64 80.57,24.64 80.57,25.55 79.65,25.55 76.5,47.6 76.5,46.69 76.5,45.77 80.47,47.6 80.47,46.69 80.47,45.77 52.73,37.39 52.73,38.4 51.61,38.4 51.61,37.39 49.38,38.4 49.38,37.39 53.65,37.39 53.65,38.4 52.73,39.32 53.65,39.32 53.65,36.47 52.73,36.47 51.61,36.47 49.38,36.47 49.38,39.32 51.61,39.32 18.03,10.67 17.02,9.65 18.03,9.65 27.58,26.52 16.61,22.86 14.48,59.64 14.48,57.81 14.48,55.78 14.48,53.95 13.56,11.99 22.91,23.47 19.15,25.09 17.63,22.86 49.12,18.49 49.02,23.67 46.69,27.84 36.32,23.77 37.34,23.77 43.64,24.49 51.77,45.31 62.54,50.9 47.5,64.82 50.65,55.27 59.74,59.69 62.23,45.21 59.74,57.15
  pour Bottom (rank 6, no thermals): 96.16,68.78 -0.15,68.78 0.25,-0.3 96.16,-0.3
  pour Top (rank 6): 96.27,69.8 -0.05,69.8 0.25,-0.3 96.16,-0.3
  pour Top: 85.19,40.03 85.19,36.27 95.15,36.27 95.15,40.03
  pour Top (no thermals): 46.99,15.44 50.04,15.44 50.04,17.17 46.99,17.17
  pour Top (no thermals): 29.31,22.66 29.31,18.8 31.75,18.8 31.75,22.66
  pour Top (no thermals): 48.92,22.35 48.92,19.81 46.38,19.81 46.38,22.35
  pour Top (no thermals): 15.6,23.57 15.6,26.52 18.64,26.52 18.64,23.57
  pour Top (no thermals): 45.67,27.53 48.92,27.53 48.92,25.7 45.67,25.7
  pour Top (rank 2, no thermals): 37.95,26.72 37.95,24.28 36.93,24.28 36.93,26.72
  pour Top (rank 2, no thermals): 12.75,15.65 12.75,14.73 15.09,14.73 15.09,15.65
  pour Top (rank 2, no thermals): 13.97,12.5 16.41,12.5 16.41,10.57 13.97,10.57
  pour Top (rank 2, no thermals): 40.49,39.22 45.87,39.22 45.87,37.8 40.49,37.8
  pour Top (no thermals): 63.86,61.47 65.18,61.47 65.18,68.68 63.86,68.68
GND1  (via drill 0.35)
  Top 0.406: 46.02,46.75 C4.2 50.4,46.75 50.45,46.79 v51.87,46.79 | v37.48,67.6 LED9.C LED8.C LED7.C LED4.C LED3.C | U9.5 58.7,50.11 | 58.7,50.11 58.37,49.78 58.37,46.94 v58.07,46.63 | v72.19,46.23 73.31,45.11 73.84,45.11 C1.2 | OK1.2 45.68,46.79 | 45.63,54.46 OK1.8 | U9.2 U9.3 55.17,51.31 56.64,51.31 57.84,50.11 58.7,50.11
  Top 0.61: v81.59,66.24 81.59,61.57 81.13,61.11 81.13,55.17 81.59,54.71 v81.59,54.46 | v81.59,50.5 81.59,44.81 | 77.88,32.61 DC1.7 | 42.47,67.18 EXP0.4
  Bottom 0.406: v72.19,46.23 71.58,46.84 58.27,46.84 | 58.27,46.84 51.92,46.84 v51.87,46.79 | v37.48,67.6 38.96,69.09 v42.83,69.09 | v58.07,46.63 58.27,46.84
  Bottom 0.61: v81.59,66.24 80.06,67.77 67.61,67.77 66.29,69.09 v42.83,69.09 | v81.59,54.46 v81.59,50.5
  pour Top (no thermals): 81.94,44.91 75.44,44.91 74.73,45.62 72.8,45.62 72.8,42.98 78.59,43.08 78.59,35.66 76.66,33.73 76.66,31.09 78.99,31.09 78.99,32.92 80.42,34.34 80.42,42.77 81.33,43.69 81.94,43.69
  pour Top (rank 2, no thermals): 46.28,46.43 44.55,46.43 44.55,54.66 46.28,54.66
  pour Top (no thermals): 41.91,61.26 41.91,69.8 43.03,69.8 43.03,61.26
I2C2_SCL  (via drill 0.25)
  Top 0.152: v46.64,9.75 46.99,10.11 v46.99,12.24 | v62.43,12.24 62.43,13.31 61.93,13.82 61.93,15.85 62.23,16.15 62.23,19.81 v62.03,20.02 62.03,23.06 61.42,23.67 61.42,27.13 62.23,27.94 62.23,28.85 63.25,29.87 63.25,31.6 v63.96,32.31 | v64.67,20.52 64.67,22.35 64.64,22.38 U7.26 | v76.61,12.65 77.27,13.31 77.27,23.27 76.86,23.67 74.52,23.67 74.22,23.98 74.22,24.69 75.13,25.6 U8.1 | U4.6 36.88,33.43 38.05,33.43 v38.46,33.02 | v17.63,8.13 17.63,8.53 17.93,8.84 19.3,8.84 19.89,9.42 U3.6
  Bottom 0.152: v46.64,9.75 46.53,9.75 45.77,8.99 P9.19 45.77,8.74 44.43,7.39 18.36,7.39 v17.63,8.13 | v46.99,12.24 47.24,12.5 62.18,12.5 | 62.18,12.5 v62.43,12.24 | v62.03,20.02 64.16,20.02 v64.67,20.52 | v76.61,12.65 76.45,12.5 62.18,12.5 | v38.46,33.02 63.25,33.02 v63.96,32.31
I2C2_SDA  (via drill 0.25)
  Top 0.152: v61.62,13.21 61.62,13.61 61.42,13.82 61.42,15.95 61.82,16.36 61.82,19.41 61.32,19.91 61.32,20.42 v61.42,20.52 61.62,20.73 61.62,22.96 61.01,23.57 61.01,27.33 61.82,28.14 61.82,29.06 62.84,30.07 62.84,32 v63.15,32.31 | v63.6,20.57 63.98,20.96 U7.27 | v77.42,12.65 77.67,12.9 77.67,23.37 76.71,24.33 U8.2 | U4.5 36.88,32.11 v38.46,32.11 | P9.20 45.26,10.87 45.26,9.86 44.35,8.94 44.35,8.23 v44.15,8.03 | v18.44,8.13 19.86,8.13 19.86,8.23 U3.5
  Bottom 0.152: P9.20 45.77,11.89 46.79,12.9 61.62,12.9 | 61.62,12.9 v61.62,13.21 | v61.42,20.52 61.47,20.57 v63.6,20.57 | v77.42,12.65 76.81,13.26 76.3,13.26 75.95,12.9 61.62,12.9 | v38.46,32.11 38.96,32.61 62.84,32.61 v63.15,32.31 | v44.15,8.03 43.89,7.77 18.8,7.77 v18.44,8.13
N$2
  Top 0.152: R1.1 47.23,45.54 OK1.1
N$3
  Top 0.152: R2.1 47.23,48.08 OK1.3
N$4
  Top 0.152: R5.1 37.76,46.81 OK1.15
N$5
  Top 0.152: R4.1 47.23,53.16 OK1.7
N$6
  Top 0.152: LED9.A R17.1
N$7
  Top 0.305: U4.1 31.9,35.97 30.12,35.97 29.62,36.47 Q1.P$1
N$8
  Top 0.406: R45.2 LED1.C
N$9
  Top 0.152: LED5.A R19.1
N$10
  Top 0.152: OK1.5 45.68,50.6 R3.1
N$11
  Top 0.305: U4.2 31.9,34.7 Q1.P$2
N$12
  Top 0.152: R21.1 55.06,53.89 U9.1
N$13
  Top 0.152: R8.2 39.15,54.41 OK1.9
N$14
  Top 0.152: OK1.11 37.81,51.89 R7.2
N$15
  Top 0.152: R6.2 39.15,49.38 OK1.13
N$16
  Top 0.254: R9.1 LED3.A
N$17
  Top 0.152: OK2.3 53.82,45.8 52.17,47.45 R21.2
N$18
  Top 0.254: LED4.A R10.1
N$20
  Top 0.254: LED7.A R12.1
N$21
  Top 0.813: L3.1 69.65,44.2 70.16,43.69 77.27,43.69 77.88,43.08 DC1.8
N$22
  Top 0.254: LED8.A R14.1
N$24  (via drill 0.25)
  Top 0.152: Q2.3 43.15,40.44 v46.58,40.44 | v49.53,40.54 49.63,40.64 U10.7
  Bottom 0.152: v46.58,40.44 49.43,40.44 v49.53,40.54
N$25
  Top 0.152: TH2.1 65.89,4.62 65.89,1.83 65.24,1.18 R15.1 R16.1
N$27
  Top 0.152: Q2.1 47.68,36.56 48.41,37.29 48.41,42.55 U10.8
N$58
  Top 0.152: U7.1 R27.1
N$59
  Top 0.152: U7.2 63.98,15.66 R26.1
N$76
  Top 0.152: U7.3 64.67,17.27 64.67,16.31 65.48,15.49 65.48,15.38 R25.1
N$94
  Top 0.152: U7.4 65.28,16.26 65.79,15.75 66.65,15.75 67,15.39 R28.1
N$95
  Top 0.152: 68.13,15.08 R29.1 68.23,15.44 67.51,16.15 66.19,16.15 65.94,16.41 U7.5
N$96
  Top 0.152: 11.8,25.7 R11.1
  Top 0.254: LED2.A 11.8,25.7
N$112
  Top 0.152: R30.1 65.98,23.61 65.94,23.57 U7.24
N$117
  Top 0.152: LED6.A R20.1
N$149
  Top 0.152: R22.1 15.05,9.51 15.06,9.53 U3.3
N$237
  Top 0.152: R38.1 R13.1 75.6,1.18 76.25,1.83 76.25,4.62 TH1.1
N$240
  Top 0.152: TH0.1 86.61,4.62 86.61,1.83 85.96,1.18 R18.1 R40.1
N$245
  Top 0.152: U2.1 34.93,22.07 35.1,22.25 40.29,22.25 C55.1
SPI1_CS0
  Top 0.152: P9.28 55.93,11.48 56.74,12.29 56.74,16.36 56.54,16.56 56.54,30.18 54.71,32 U10.16
SPI1_MISO  (via drill 0.25)
  Top 0.152: v69.7,9.7 70.26,10.26 70.26,10.77 70.1,10.92 70.1,13.36 v70.26,13.51 | U10.15 53.44,34.39 v53.7,34.64 | v72.7,13.51 72.9,13.72 72.9,14.22 72.7,14.43 72.7,28.75 v72.49,28.96 | v67.41,28.96 v67.41,34.64
  Bottom 0.152: P9.29 58.47,7.97 58.67,7.77 61.47,7.77 62.08,8.38 62.08,9.4 62.59,9.91 69.5,9.91 v69.7,9.7 | v53.7,34.64 v67.41,34.64 | v70.26,13.51 70.36,13.61 70.56,13.61 70.87,13.31 72.49,13.31 v72.7,13.51 | v72.49,28.96 72.29,29.16 67.61,29.16 v67.41,28.96
SPI1_MOSI  (via drill 0.25)
  Top 0.152: v57.71,9.86 57.71,10.11 58.47,10.87 P9.30 | U10.14 52.17,34.34 v52.48,34.64 | v66.4,35.36 66.4,34.85 67,34.24 67,29.36 66.8,29.16 v66.8,28.45 | v71.83,28.55 72.29,28.09 72.29,14.22 v72.19,14.12 | v69.55,13.92 69.55,13.31 69.7,13.16 69.7,10.62 v69.65,10.57
  Bottom 0.152: v57.71,9.86 57.76,9.91 59.74,9.91 59.89,9.75 60.3,9.75 60.86,10.31 69.39,10.31 v69.65,10.57 | v52.48,34.64 53.09,35.25 54,35.25 54.2,35.05 66.09,35.05 v66.4,35.36 | v66.8,28.45 66.9,28.35 67.61,28.35 68.02,28.75 71.63,28.75 v71.83,28.55 | v72.19,14.12 69.75,14.12 v69.55,13.92
SPI1_SCLK  (via drill 0.25)
  Top 0.152: P9.31 62.08,9.91 62.08,11.84 61.01,12.9 61.01,19.61 60.5,20.12 60.5,31.9 59.79,32.61 59.79,35.46 v59.59,35.66 | v51.26,34.64 50.9,34.29 U10.13
  Bottom 0.152: v59.59,35.66 59.39,35.46 54.41,35.46 54.2,35.66 52.27,35.66 v51.26,34.64
SW
  pour Top (rank 2, no thermals): 25.04,19.81 25.04,21.84 25.65,21.84 25.65,19.2 24.43,17.98 24.43,15.04 22.3,15.04 22.37,17.49 20.9,18.9 18.64,18.9 17.93,19.61 16,19.61 16,21.74 18.44,21.74 18.44,21.03 20.88,21.03 20.88,19.81
SW_0  (via drill 0.25)
  Top 0.152: P9.25 54.46,9.91 54.46,12.14 54.36,12.24 54.36,16.46 v54.26,16.56 | v56.03,16.15 55.93,16.26 55.93,23.98 54.79,25.12 U5.2
  Bottom 0.152: v54.26,16.56 55.83,16.56 56.03,16.36 v56.03,16.15
SW_0_IN  (via drill 0.25)
  Top 0.152: U5.3 54.38,23.85 55.52,22.71 55.52,16.46 55.22,16.15 55.22,15.55 v55.83,14.93 | v58.67,14.32 58.88,14.12 58.88,12.5 59.54,11.84 59.54,7.93 59.23,7.62 58.47,7.62 v58.07,7.21
  Bottom 0.152: v55.83,14.93 58.07,14.93 v58.67,14.32 | ISW.3 44.96,5.18 46.79,7.01 57.86,7.01 v58.07,7.21
SW_1
  Top 0.152: U5.4 53.11,22.58 51.66,21.13 51.66,16.76 52.07,16.36 52.07,12.95 51.61,12.5 50.45,12.5 49.78,11.84 49.78,10.92 50.85,9.86 P9.23
SW_1_IN  (via drill 0.25)
  Top 0.152: U5.5 54.94,21.31 55.12,21.13 55.12,16.56 54.81,16.26 54.81,15.04 v55.02,14.83 | v57.86,14.32 57.86,12.29 57.4,11.84 57.4,10.52 57.15,10.26 57.15,9.65 57.4,9.4 57.4,6.25 56.74,5.59 56.74,3.56 v56.54,3.35
  Bottom 0.152: v55.02,14.83 55.02,14.73 55.42,14.32 v57.86,14.32 | ISW.4 42.27,4.22 42.62,3.86 43.59,3.86 44.3,3.15 48.82,3.15 49.02,3.35 51.66,3.35 51.74,3.43 52.5,3.43 52.78,3.15 56.34,3.15 v56.54,3.35
SW_2  (via drill 0.25)
  Top 0.152: v51.66,10.31 51.92,10.57 51.92,12.24 52.48,12.8 52.48,16.51 52.07,16.92 52.07,19.1 53.01,20.04 U5.6 | v41.61,10.36 41.61,9.75 P9.15
  Bottom 0.152: v41.61,10.36 41.66,10.31 43.69,10.31 44.04,10.67 44.96,10.67 45.31,10.31 v51.66,10.31
SW_2_IN  (via drill 0.25)
  Top 0.152: U5.7 52.96,18.77 52.48,18.29 52.48,17.07 52.98,16.56 52.98,12.5 52.32,11.84 52.32,3.1 v52.12,2.89
  Bottom 0.152: ISW.5 39.78,5.13 39.78,3.35 39.98,3.15 42.32,3.15 42.57,3.4 43.48,3.4 44.15,2.74 48.92,2.74 49.15,2.97 50.52,2.97 50.8,2.69 51.92,2.69 v52.12,2.89
SW_3  (via drill 0.25)
  Top 0.152: U5.10 58.78,18.8 59.79,18.8 60.2,18.39 60.2,14.73 60.5,14.43 60.5,13.61 v60.4,13.51 | v51.46,13.51 51.46,13.16 51.21,12.9 50.34,12.9 49.38,11.94 49.38,7.87 v49.12,7.62 | v41.4,6.81 42.16,7.57 42.16,10.92 41.71,11.38 P9.16
  Bottom 0.152: v60.4,13.51 60.2,13.31 51.66,13.31 v51.46,13.51 | v49.12,7.62 48.92,7.42 46.28,7.42 45.87,7.01 41.61,7.01 v41.4,6.81
SW_3_IN  (via drill 0.25, 0.25 pad 0.25)
  Top 0.152: v59.89,14.12 59.69,14.32 59.69,16.36 59.79,16.46 59.79,16.97 59.26,17.5 U5.9 58.78,17.53 | v54.61,2.49 54.86,2.74 54.86,13.77 v55.02,13.92 | ISW.6 37.24,5.13 37.24,3.05 v37.44,2.85
  Bottom 0.152: v55.02,13.92 55.22,13.72 59.49,13.72 v59.89,14.12 | v54.61,2.49 54.41,2.29 50.55,2.29 50.29,2.54 49.23,2.54 48.97,2.29 43.99,2.29 43.28,3 42.77,3 42.47,2.69 37.59,2.69 v37.44,2.85
SW_4_IN  (via drill 0.25)
  Top 0.152: U5.11 57.73,20.04 57.4,19.71 57.4,17.12 57.66,16.86 58.98,16.86 59.28,16.56 59.28,12.65 59.94,11.99 59.94,10.46 v60.1,10.31 | v47.5,9.75 47.14,9.4 47.14,8.28 45.87,7.01 43.89,7.01 43.33,6.45 43.33,2.79 v42.98,2.44 | ISW.7 34.65,2.59 v34.8,2.44
  Bottom 0.152: v47.5,9.75 47.65,9.91 51.31,9.91 51.46,9.75 51.87,9.75 52.43,10.31 57.4,10.31 57.51,10.41 57.91,10.41 58.01,10.31 v60.1,10.31 | v34.8,2.44 34.95,2.29 42.83,2.29 v42.98,2.44
SW_5_IN  (via drill 0.25)
  Top 0.152: U5.14 57.73,23.85 56.95,23.06 56.95,16.66 57.15,16.46 57.15,12.09 57,11.94 57,10.72 56.74,10.46 56.74,9.55 57,9.3 57,6.35 56.34,5.69 56.34,3.96 55.93,3.56 55.93,2.29 v55.73,2.08 | ISW.8 32.16,5.13 32.16,2.29 v32.36,2.08
  Bottom 0.152: v32.36,2.08 32.56,1.88 49.07,1.88 49.33,2.13 50.14,2.13 50.39,1.88 55.52,1.88 v55.73,2.08
SW_12V  (via drill 0.35)
  Top 0.406: U2.8 34.93,23.24 v35.1,23.06
  Bottom 0.406: v35.1,23.06 35.31,22.86 v42.72,22.86
  pour Top (rank 2, no thermals): 38.46,21.84 38.46,20.12 35.92,17.58 35.92,15.04 37.34,15.04 42.11,19.81 44.45,19.81 44.45,23.06 42.62,23.06 40.79,21.23 39.68,21.23 39.07,21.84
SW_EXT0
  Top 0.152: U6.2 34.19,46.79 32.97,46.79 32.05,47.7 32.05,54.92 31.8,55.17 27.84,55.17 26.47,56.54 26.47,56.95 26.31,57.1 P8.3
SW_EXT0_IN
  Top 0.152: U6.3 34.67,48.08 35.97,46.79 R5.2
SW_EXT1
  Top 0.152: U6.4 33,49.35 32.46,49.89 32.46,55.07 31.95,55.58 27.99,55.58 26.87,56.69 26.87,59.13 26.36,59.64 P8.4
SW_EXT1_IN
  Top 0.152: U6.5 34.77,50.62 36.02,49.38 R6.1
SW_EXT2
  Top 0.152: U6.6 33.2,51.89 32.87,52.22 32.87,55.22 32.11,55.98 28.35,55.98 27.99,56.34 P8.5
SW_EXT2_IN
  Top 0.152: U6.7 34.82,53.16 36.17,51.82 R7.1
SW_EXT3  (via drill 0.35)
  Top 0.152: U6.10 29.26,53.19 28.09,53.19 27.79,53.49 v27.79,54.56
  Bottom 0.152: v27.79,54.56 28.14,54.92 28.9,54.92 29.21,55.22 29.21,57.56 27.99,58.78 P8.6
SW_EXT3_IN  (via drill 0.25, 0.35)
  Top 0.152: U6.9 30.71,54.43 v30.84,54.56 | v37.24,55.27 37.24,54.56 37.11,54.43 36.56,54.43 R8.1
  Bottom 0.152: v30.84,54.56 30.99,54.71 37.08,54.71 37.24,54.86 v37.24,55.27
SYS_5V  (via drill 0.35)
  Top 0.406: 29.41,5.28 29.41,2.23 v29.01,1.83 | v49.68,1.52 49.89,1.73 ISW.1 | 29.41,5.28 29.51,5.18 ISW.9 | 29.41,5.28 30.53,6.4 P9.7
  Top 1.676: P9.7 P9.8
  Bottom 0.406: v29.01,1.83 29.46,1.37 49.53,1.37 v49.68,1.52
SYS_RESET  (via drill 0.25)
  Top 0.152: v44.04,12.6 44.25,12.8 44.25,14.22 v44.04,14.43 | v57.15,28.14 57.15,30.07 56.03,31.19 56.03,33.15 U10.17 | v49.84,17.27 50.04,17.48 50.04,27.53 v49.84,27.74
  Bottom 0.152: P9.10 33.07,12.19 33.48,12.6 v44.04,12.6 | v57.15,28.14 56.95,28.35 52.07,28.35 51.46,27.74 v49.84,27.74 | v44.04,14.43 44.65,15.04 45.26,15.04 45.67,14.63 49.12,14.63 49.84,15.34 v49.84,17.27
TERM_EXT_0  (via drill 0.25)
  Top 0.152: R40.2 C46.1 79.76,5.04 79.76,6.86 v79.6,7.01 | v71.17,7.31 P9.39
  Bottom 0.152: v79.6,7.01 71.48,7.01 v71.17,7.31
TERM_EXT_1
  Top 0.152: R38.2 C26.1 68.69,4.23 70.1,5.64 70.1,9.3 71.17,10.36 P9.40
TERM_EXT_2  (via drill 0.25)
  Top 0.152: R16.2 58.22,2.89 58.52,3.2 C3.1 59.29,4.23 59.54,4.47 59.54,6.81 v59.34,7.01 | v68.63,7.31 P9.37
  Bottom 0.152: v59.34,7.01 68.33,7.01 v68.63,7.31
UART4_RXD  (via drill 0.25)
  Top 0.152: R31.2 62.13,46.8 v62.13,46.13 61.8,45.8 OK2.6 | v44.65,10.06 44.65,14.12 v44.96,14.43 | v49.94,14.53 50.45,15.04 50.45,28.04 50.24,28.25 50.24,45.31 v50.45,45.52
  Bottom 0.152: P9.11 36.68,9.91 41.15,9.91 41.3,9.75 41.91,9.75 42.06,9.91 44.5,9.91 v44.65,10.06 | v44.96,14.43 45.16,14.22 49.63,14.22 v49.94,14.53 | v50.45,45.52 51.05,46.13 57.66,46.13 57.86,45.92 61.93,45.92 v62.13,46.13
UART5_RXD  (via drill 0.25)
  Top 0.152: v49.33,58.83 49.38,58.88 49.38,60.71 48.82,61.27 48.82,62.53 EXP0.9
  Bottom 0.152: P8.38 67.56,58.57 50.39,58.57 50.24,58.73 49.43,58.73 v49.33,58.83
UART5_TXD  (via drill 0.25)
  Top 0.152: v50.09,58.12 49.94,58.27 49.94,58.98 49.78,59.13 49.78,60.81 49.43,61.16 49.43,64.62 48.72,65.33 48.72,66.93 EXP0.10
  Bottom 0.152: P8.37 67.56,58.17 50.14,58.17 v50.09,58.12
VBAT+  (via drill 0.35)
  Top 0.406: v27.13,46.69 27.58,46.23 27.58,33.53 28.4,32.72 30.23,32.72 30.84,33.33 31.24,33.33 31.32,33.4 U4.3 | v8.38,47.95 6.2,47.95 B1.+1 | 7.09,64.29 B1.+2
  Top 0.61: 7.09,64.29 11.53,59.84 11.53,52.63 8.18,49.28 7.27,49.28 6.4,48.41 B1.+1
  Bottom 0.406: v27.13,46.69 26.67,47.14 21.89,47.14 21.49,47.55 19.96,47.55 19.25,46.84 9.5,46.84 v8.38,47.95
VDD_12V  (via drill 0.25, 0.35, 0.35 pad 0.25, 0.5)
  Top 0.152: v27.89,65.12 27.89,64.41 28.44,63.87 R19.2 R20.2
  Top 0.406: v23.82,28.35 23.72,28.45 23.72,29.57 | 23.72,29.57 23.72,55.58 24.18,56.03 v24.18,64.67 | v73.36,30.63 72.8,31.19 DC1.3 | v44.5,27.94 44.3,28.14 44.3,29.67 v44.5,29.87 | 12V.TP 23.72,29.57 | v38.15,19.3 38.73,19.89 U2.4 | L2.2 42.72,16.86 | v41.91,18.49 42.32,18.09 42.32,17.68 | EXP0.21 60.5,62.9 v60.5,64.82
  Top 0.61: v44.5,27.94 45.16,27.28 45.16,16.97
  Bottom 0.406: v44.5,29.87 44.65,29.72 71.63,29.72 72.8,30.89 73.1,30.89 v73.36,30.63 | v41.91,18.49 41.4,19 38.46,19 v38.15,19.3
  Bottom 0.61: v44.5,27.94 44.4,28.04 24.13,28.04 v23.82,28.35 | v60.5,64.82 60.2,64.82 58.98,63.6 56.95,63.6 54.81,65.73 44.04,65.73 42.01,63.7 40.89,63.7 39.47,65.12 v27.89,65.12 24.64,65.12 v24.18,64.67
  pour Top (no thermals): 40.69,17.68 40.69,14.83 43.03,14.83 43.64,15.44 45.97,15.44 45.97,17.07 43.74,17.07 43.13,17.68
  pour Top (no thermals): 60,61.47 61.01,61.47 61.01,68.68 60,68.68
VDD_ADC  (via drill 0.25)
  Top 0.152: P9.32 61.01,10.36 59.94,9.3 59.94,4.27 59.34,3.66 R15.2 59.38,2.44 v60.4,2.44 | R13.2 69.74,2.44 v70.77,2.44 | v81.13,2.44 80.1,2.44 R18.2
  Bottom 0.152: v60.4,2.44 v70.77,2.44 v81.13,2.44
VDD_IN  (via drill 0.35, 0.75)
  Top 0.254: v16,26.92 14.68,25.6 R11.2
  Top 0.406: 78.49,52.42 78.49,52.62 | v28.6,27.13 28.7,27.13 28.96,27.38 28.96,27.48 | R45.1 79.6,62.18 80.31,61.47 80.31,54.66 80.82,54.15 80.82,53.64
  Top 0.61: 26.52,29.92 12..24V.TP | RL1.2 87.63,36.05 87.63,40.84
  Top 0.813: v24.89,53.34 24.89,31.55 26.52,29.92 28.96,27.48 29.77,26.67
  Top 1.422: v75.64,53.34 76.56,52.42 78.49,52.42
  Bottom 0.254: v28.6,27.13 28.45,27.28 16.36,27.28 v16,26.92
  Bottom 1.422: v75.64,53.34 v24.89,53.34
  pour Top (rank 2, no thermals): 76.15,53.64 103.56,53.64 103.53,33.12 82.19,33.12 82.14,49.89 76.15,49.89
  pour Top (no thermals): 28.4,27.84 43.99,27.84 arc-90 44.25,27.58 44.25,26.16 arc-90 43.99,25.91 39.62,25.91 arc-90 39.37,26.16 39.37,26.92 36.53,26.92 36.53,24.69 35.81,24.69 35.81,26.92 34.29,26.92 34.29,26.06 arc-90 34.04,25.81 32.51,25.81 arc90 32.26,25.55 32.26,24.13 arc-90 32,23.88 28.91,23.88 27.69,22.66 25.05,22.66 arc45 24.87,22.58 24.33,22.05 24.33,20.02 23.83,20.02 23.83,23.37 25.25,24.79 27.28,24.79 28.32,25.83 arc45 28.4,26.01
VIN  (via drill 0.35)
  Top 0.406: v80.62,62.28 80.62,66.59 LED1.A
  Bottom 0.406: v80.62,62.28 83.06,59.84 83.47,59.84
  pour Top (isolate 0.254, rank 2, no thermals): 103.78,72.44 103.58,57.71 82.25,57.71 82.25,62.18 87.83,62.18 87.88,72.44
  pour Bottom (isolate 0.254, no thermals): 83.16,61.37 83.16,57.71 94.03,57.71 94.03,61.37

## Text on the board
tNames: Rev A1 | ArmazCape | ExMachina | By
tDocu: Fuse / 5A
_tplace: 1 | 1 | 2 | 2 | 1 | 1 | 2 | 2 | 1 | 1 | 4 | 4 | 1 | 1 | 4 | 4 | 1 | 1 | 4 | 4 | 1 | 1 | 4 | 4 | 3 | 3 | 2 | 2 | 1 | 1 | * | * | 1 | 1 | L3 | L3 | 33uH | 33uH | 4 | 4 | * | * | 2 | 2 | 1 | 1 | 1 | 1 | ON | ON | * | * | 3 | 3 | 1 | 1 | 3 | 3 | 1 | 1 | 3 | 3 | 1 | 1 | 3 | 3 | 1 | 1 | 3 | 3 | 1 | 1 | 3 | 3 | 1 | 1 | 3 | 3 | 1 | 1 | 3 | 3 | 1 | 1 | 3 | 3 | 1 | 1 | 10 | 10